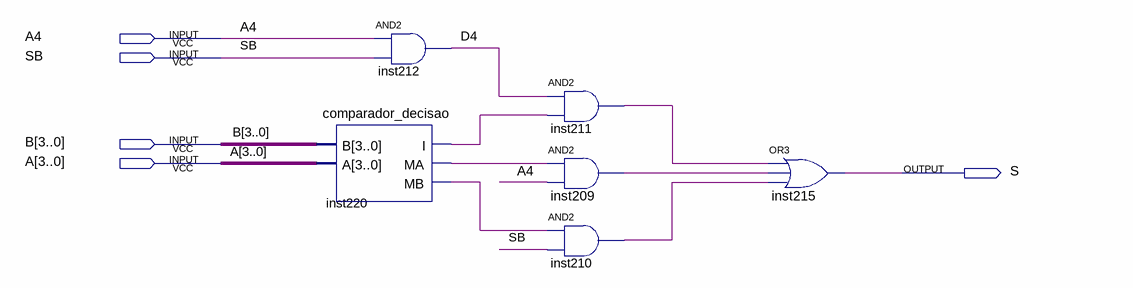
[diagram p0: schematic sheet]
// Quartus schematic sinal_saida.bdf as structural Verilog: 6 symbols, 5 pins
module sinal_saida (
  input  A4,
  input  SB,
  input  [3:0] B,
  input  [3:0] A,
  output S
);

  wire D4, inst209_out, inst210_out, inst211_out, inst220_i, inst220_ma, inst220_mb;

  comparador_decisao inst220 (.B(B), .A(A), .I(inst220_i), .MA(inst220_ma), .MB(inst220_mb));
  and inst212 (D4, A4, SB);
  and inst211 (inst211_out, D4, inst220_i);
  and inst209 (inst209_out, inst220_ma, A4);
  and inst210 (inst210_out, inst220_mb, SB);
  or inst215 (S, inst211_out, inst209_out, inst210_out);
endmodule
